# EAGLE design PARADAS -02 (EAGLE 6.5.0)
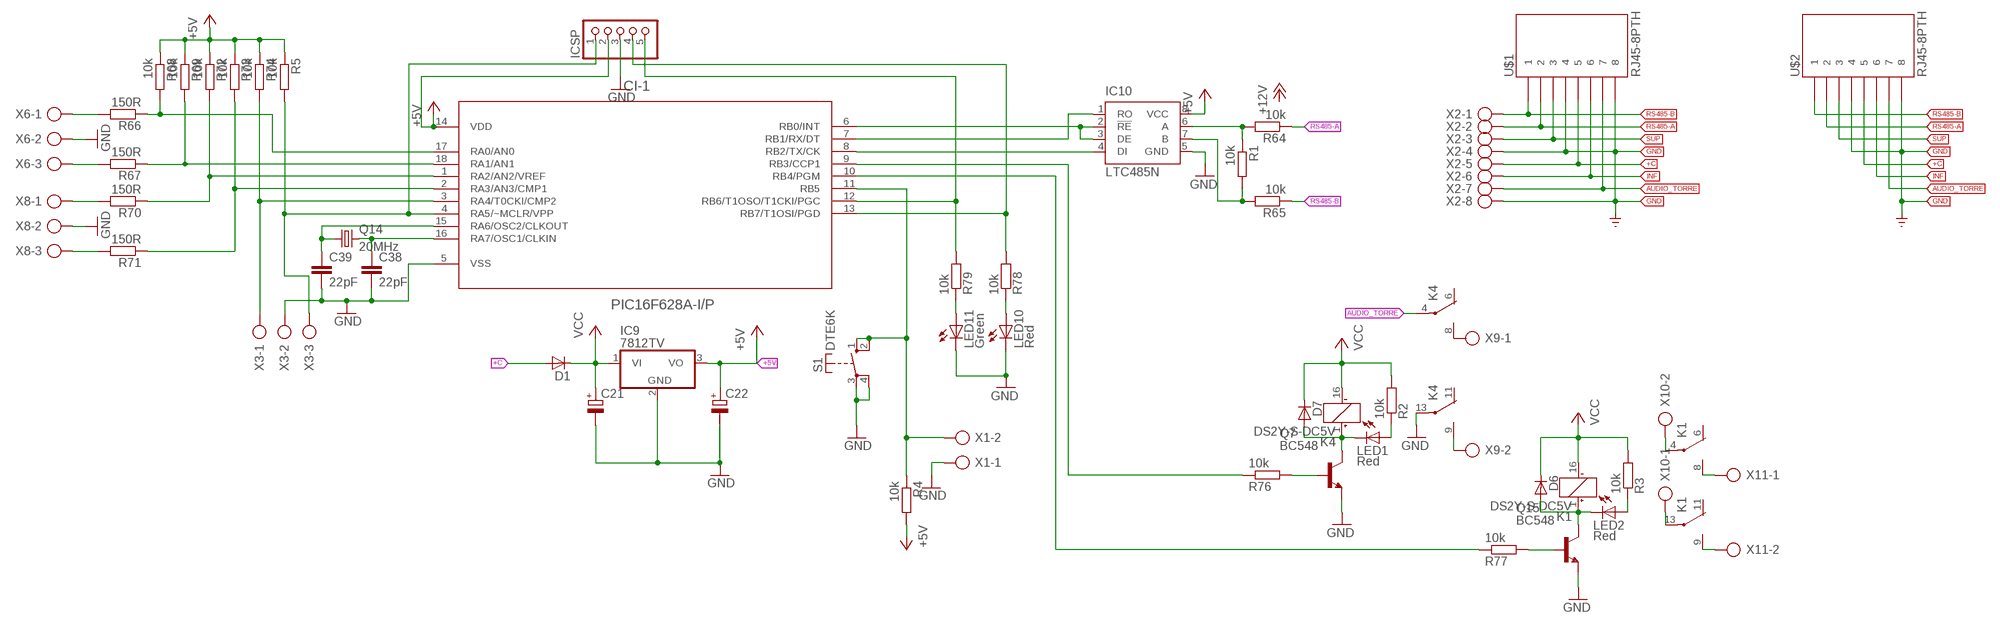
[diagram p0: schematic, sheet 1]

## Parts
C21  CPOL-EUE5-13  [E5-13]
C22  CPOL-EUE5-13  [E5-13]
C38  22pF  C-EUC0805  [C0805]
C39  22pF  C-EUC0805  [C0805]
CI-1  PIC16F628A-I/P  [DIP254P762X533-18]
D1  BYS10  [SOD106A]
D6  BYS10  [SOD106A]
D7  BYS10  [SOD106A]
IC9  7812TV  [TO220V]
IC10  LTC485N  [DIL08]
ICSP  PINHD-1X5  [1X05]
K1  DS2Y-S-DC5V  [DS2Y]
K4  DS2Y-S-DC5V  [DS2Y]
LED1  Red  LED5MM  [LED5MM]
LED2  Red  LED5MM  [LED5MM]
LED10  Red  LED5MM  [LED5MM]
LED11  Green  LED5MM  [LED5MM]
Q7  BC548  [TO92-EBC]
Q14  20MHz  CRYTALHC18U-V  [HC18U-V]
Q15  BC548  [TO92-EBC]
R1  10k  R-EU_0207/10  [0207/10]
R2  10k  R-EU_0207/10  [0207/10]
R3  10k  R-EU_0207/10  [0207/10]
R4  10k  R-EU_0207/10  [0207/10]
R5  10k  R-EU_0207/10  [0207/10]
R64  10k  R-EU_0207/10  [0207/10]
R65  10k  R-EU_0207/10  [0207/10]
R66  150R  R-EU_0207/10  [0207/10]
R67  150R  R-EU_0207/10  [0207/10]
R68  10k  R-EU_0207/10  [0207/10]
R69  10k  R-EU_0207/10  [0207/10]
R70  150R  R-EU_0207/10  [0207/10]
R71  150R  R-EU_0207/10  [0207/10]
R72  10k  R-EU_0207/10  [0207/10]
R73  10k  R-EU_0207/10  [0207/10]
R74  10k  R-EU_0207/10  [0207/10]
R76  10k  R-EU_0207/10  [0207/10]
R77  10k  R-EU_0207/10  [0207/10]
R78  10k  R-EU_0207/10  [0207/10]
R79  10k  R-EU_0207/10  [0207/10]
S1  DTE6K  [DTE6K]
U$1  RJ45-8PTH  [RJ45-8]
U$2  RJ45-8PTH  [RJ45-8]
X1  AK500/2  [AK500/2]
X2  RS485_CNT  AK500/8  [AK500/8]
X3  AK500/3  [AK500/3]
X6  AK500/3  [AK500/3]
X8  AK500/3  [AK500/3]
X9  AK500/2  [AK500/2]
X10  AK500/2  [AK500/2]
X11  AK500/2  [AK500/2]

## Nets
+5V [power]: C22.+ CI-1.14(VDD) IC9.3(VO) IC10.8(VCC) ICSP.2 R4.2 R5.1 R68.1 R69.1 R72.1 R73.1 R74.1
+C [AC]: D1.A U$1.5 U$2.5 X2.5
AUDIO_TORRE [AC]: K4.4(2:P) U$1.7 U$2.7 X2.7
GND [power]: C21.- C22.- C38.2 C39.2 CI-1.5(VSS) IC9.2(GND) IC10.5(GND) ICSP.3 K4.13(3:P) LED10.K(C) LED11.K(C) Q7.E Q15.E S1.3(P) S1.4(P) U$1.4 U$1.8 U$2.4 U$2.8 X1.1 X2.4 X2.8 X3.2 X6.2 X8.2
INF [power]: U$1.6 U$2.6 X2.6
N$1: LED1.A R2.1
N$2: IC10.7(B) R1.2 R65.2
N$3: IC10.6(A) R1.1 R64.2
N$4: LED2.A R3.1
N$5: CI-1.11(RB5) R4.1 S1.1(S) S1.2(S) X1.2
N$6: CI-1.8(RB2/TX/CK) IC10.4(DI)
N$7 [AC]: K1.4(2:P) X10.2
N$8: CI-1.6(RB0/INT) IC10.2(!RE) IC10.3(DE)
N$9 [AC]: K1.13(3:P) X10.1
N$12: CI-1.4(RA5/~MCLR/VPP) ICSP.1 R5.2 X3.3
N$13: CI-1.13(RB7/T1OSI/PGD) ICSP.4 R78.2
N$14: CI-1.12(RB6/T1OSO/T1CKI/PGC) ICSP.5 R79.2
N$16: CI-1.7(RB1/RX/DT) IC10.1(RO)
N$20: C38.1 CI-1.16(RA7/OSC1/CLKIN) Q14.2
N$22: C39.1 CI-1.15(RA6/OSC2/CLKOUT) Q14.1
N$23: R66.2 X6.1
N$24: CI-1.17(RA0/AN0) R66.1 R68.2
N$26: R67.2 X6.3
N$28: R70.2 X8.1
N$29: CI-1.1(RA2/AN2/VREF) R70.1 R72.2
N$30: CI-1.18(RA1/AN1) R67.1 R69.2
N$32: CI-1.2(RA3/AN3/CMP1) R71.1 R73.2
N$33: R71.2 X8.3
N$36: CI-1.3(RA4/T0CKI/CMP2) R74.2 X3.1
N$37 [AC]: K4.8(2:S) X9.1
N$38 [AC]: K4.9(3:S) X9.2
N$41: D7.A K4.1(1:+) LED1.K(C) Q7.C
N$42: Q7.B R76.2
N$43 [AC]: K1.9(3:S) X11.2
N$45 [AC]: K1.8(2:S) X11.1
N$46: CI-1.9(RB3/CCP1) R76.1
N$47: CI-1.10(RB4/PGM) R77.1
N$48: D6.A K1.1(1:+) LED2.K(C) Q15.C
N$50: Q15.B R77.2
N$54: LED10.A R78.1
N$55: LED11.A R79.1
RS485-A [power]: R64.1 U$1.2 U$2.2 X2.2
RS485-B [power]: R65.1 U$1.1 U$2.1 X2.1
SUP [power]: U$1.3 U$2.3 X2.3
VCC [power]: C21.+ D1.K D6.K D7.K IC9.1(VI) K1.16(1:-) K4.16(1:-) R2.2 R3.2
Unconnected: K1.6(2:O) K1.11(3:O) K4.6(2:O) K4.11(3:O)

## Library data of the parts
C21 C22 = rcl:CPOL-EU: POLARIZED CAPACITOR, European symbol
C38 C39 = rcl:C-EU: CAPACITOR, European symbol
CI-1 = Microchip_By_element14_Batch_1 (2):PIC16F628A-I/P: 8 Bit CMOS Microcontrollers; DESCRIPTION: 8 Bit CMOS Microcontrollers; MPN: PIC16F628A-I/P; OC_FARNELL: 9760423; OC_NEWARK: 92C4532; PACKAGE: DIP-18; SUPPLIER: Microchip
D1 D6 D7 = telefunken:BYS10: DIODE; MPN: BYS10/45; OC_FARNELL: 9549188; OC_NEWARK: 96K7236
IC9 = linear:78*: Positive VOLTAGE REGULATOR Source: http://cache.national.com/ds/LM/LM78L05.pdf http://www.fairchildsemi.com/ds/LM/LM7805.pdf
IC10 = linear-technology:LTC485: Low Power RS485 Interface Transceiver Source: http://www.linear.com/pc/downloadDocument.do?navId=H0,C1,C1007,C1017,P2064,D1718; OC_FARNELL: unknown; OC_NEWARK: unknown
ICSP = pinhead:PINHD-1X5: PIN HEADER
K1 K4 = relay:DS2Y-S-DC*: MINIATURE RELAY NAiS Source: http://www.mew-europe.com/.. en_ds_61005_0023.pdf; MPN: DS2Y-S-DC5V; OC_FARNELL: unknown; OC_NEWARK: 13P3268
LED1 LED2 LED10 LED11 = led:LED: LED OSRAM: - CHIPLED LG R971, LG N971, LY N971, LG Q971, LY Q971, LO R971, LY R971 LH N974, LH R974 LS Q976, LO Q976, LY Q976 LO Q996 - Hyper CHIPLED LW Q18S LB Q993, LB Q99A, LB R99A - SideLED LS A670, LO A670, LY A670, LG A670, LP A670 LB A673, LV A673, LT A673, LW A673 LH A674 LY A675 LS A676, LA A676, LO A676, LY A676, LW A676 LS A679, LY A679, LG A679 - Hyper Micro SIDELED® LS Y876, LA Y876, LO Y876, LY Y876 LT Y87S - SmartLED LW L88C, LW L88S LB L89C, LB L89S, LG L890 LS L89K, LO L89K, LY L89K LS L896, LA L896, LO L896, LY L896 - TOPLED LS T670, LO T670, LY T670, LG T670, LP T670 LSG T670, LSP T670, LSY T670, LOP T670, LYG T670 LG T671, LOG T671, LSG T671 LB T673, LV T673, LT T673, LW T673 LH T674 LS T676, LA T676, LO T676, LY T676, LB T676, LH T676, LSB T676, LW T676 LB T67C, LV T67C, LT T67C, LS T67K, LO T67K, LY T67K, LW E67C LS E67B, LA E67B, LO E67B, LY E67B, LB E67C, LV E67C, LT E67C LW T67C LS T679, LY T679, LG T679 LS T770, LO T770, LY T770, LG T770, LP T770 LB T773, LV T773, LT T773, LW T773 LH T774 LS E675, LA E675, LY E675, LS T675 LS T776, LA T776, LO T776, LY T776, LB T776 LHGB T686 LT T68C, LB T68C - Hyper Mini TOPLED® LB M676 - Mini TOPLED Santana® LG M470 LS M47K, LO M47K, LY M47K Source: http://www.osram.convergy.de LUXEON: - LUMILED® LXK2-PW12-R00, LXK2-PW12-S00, LXK2-PW14-U00, LXK2-PW14-V00 LXK2-PM12-R00, LXK2-PM12-S00, LXK2-PM14-U00 LXK2-PE12-Q00, LXK2-PE12-R00, LXK2-PE12-S00, LXK2-PE14-T00, LXK2-PE14-U00 LXK2-PB12-K00, LXK2-PB12-L00, LXK2-PB12-M00, LXK2-PB14-N00, LXK2-PB14-P00, LXK2-PB14-Q00 LXK2-PR12-L00, LXK2-PR12-M00, LXK2-PR14-Q00, LXK2-PR14-R00 LXK2-PD12-Q00, LXK2-PD12-R00, LXK2-PD12-S00 LXK2-PH12-R00, LXK2-PH12-S00 LXK2-PL12-P00, LXK2-PL12-Q00, LXK2-PL12-R00 Source: www.luxeon.com KINGBRIGHT: KA-3528ASYC Source: www.kingbright.com
Q7 Q15 = transistor-npn:BC548*: NPN Transistor
Q14 = crystal:CRYTAL: CRYSTAL
R1-R5 R64-R74 R76-R79 = rcl:R-EU_: RESISTOR, European symbol
S1 = switch-misc:DT: ITT SWITCH
U$1 U$2 = SparkFun-Connectors:RJ45-8: RJ45 Jack Simple RJ45, 8-pin connection - connector for common Cat5, Cat5e, and Cat6 Ethernet cables. Footprint not yet proven in production. Connector sku is PRT-00643; Breakout PCB sku is BOB-00716.
X1 X9-X11 = con-ptr500:AK500/2: CONNECTOR; OC_FARNELL: unknown; OC_NEWARK: unknown
X2 = con-ptr500:AK500/8: CONNECTOR; OC_FARNELL: unknown; OC_NEWARK: unknown
X3 X6 X8 = con-ptr500:AK500/3: CONNECTOR; OC_FARNELL: unknown; OC_NEWARK: unknown

## Net classes
0 default: width 0.508 mm, drill 0.254 mm, clearance 0.203 mm
1 AC: width 1.524 mm, drill 0.254 mm, clearance 0.203 mm
2 power: width 0.762 mm, drill 0.254 mm, clearance 0.203 mm

## Board
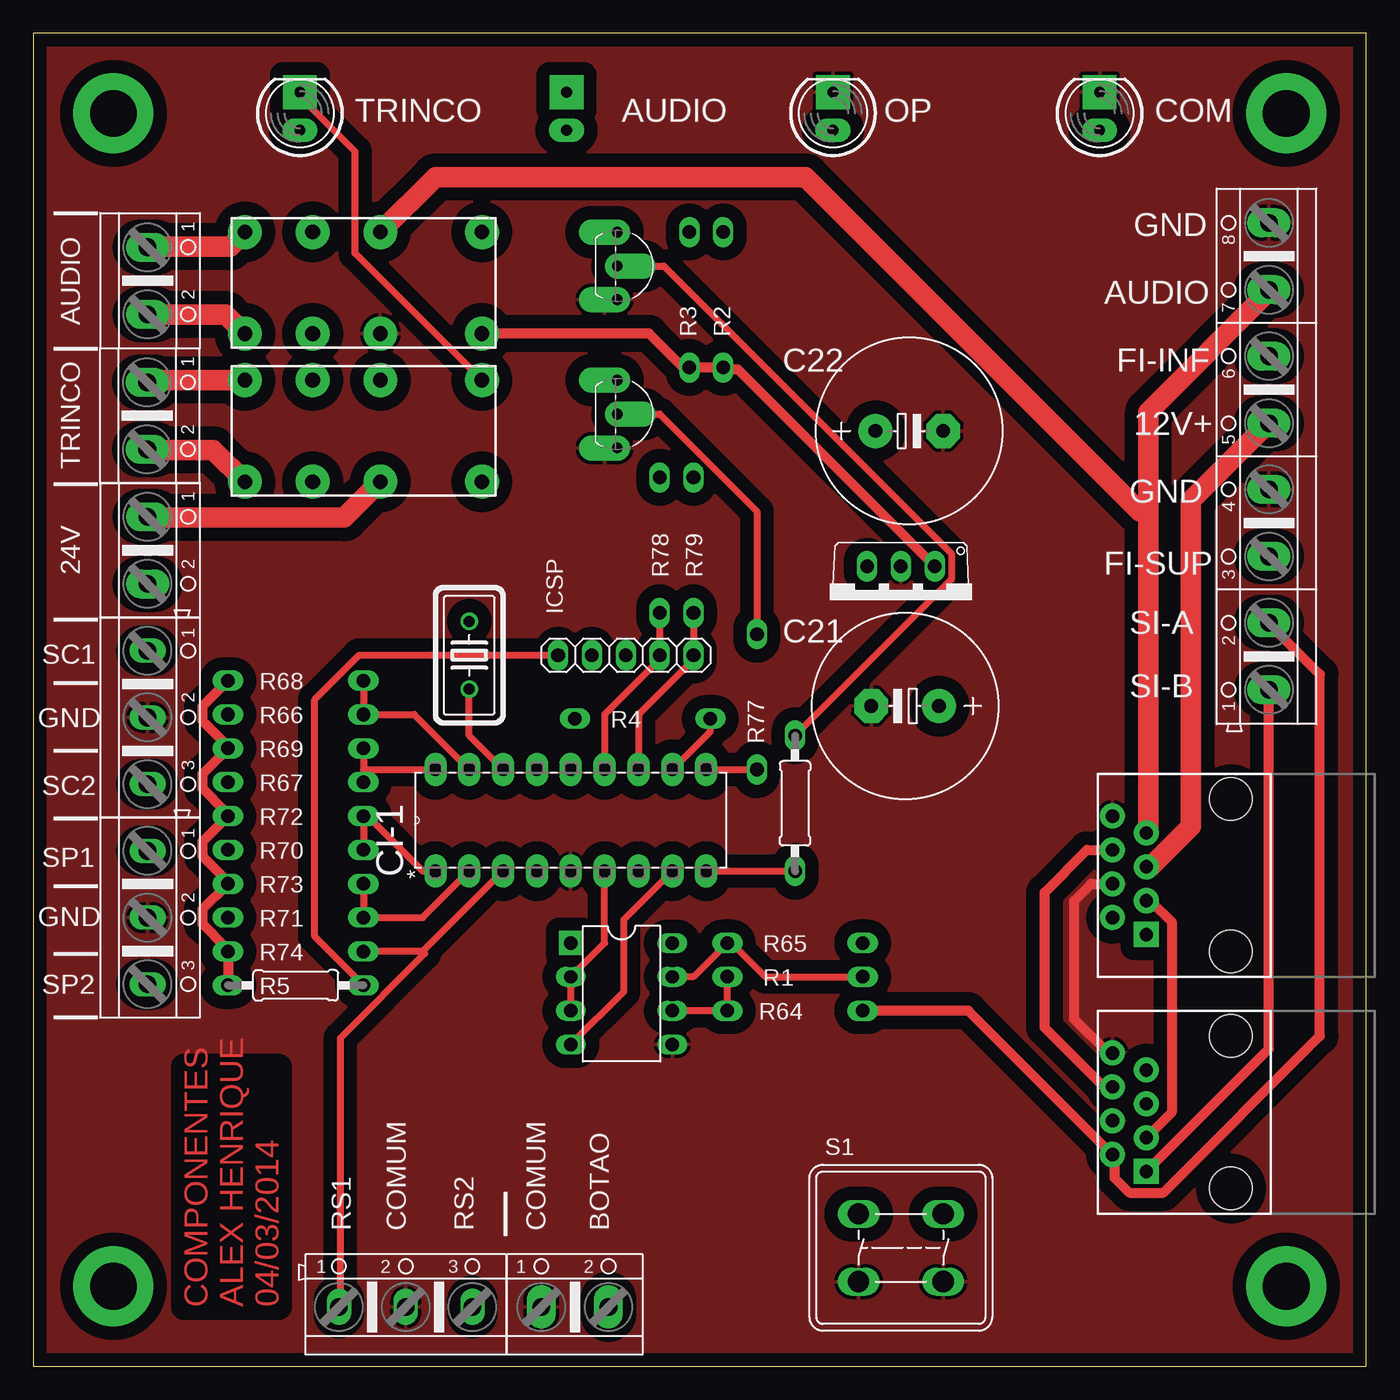
[diagram p1: board, top side]
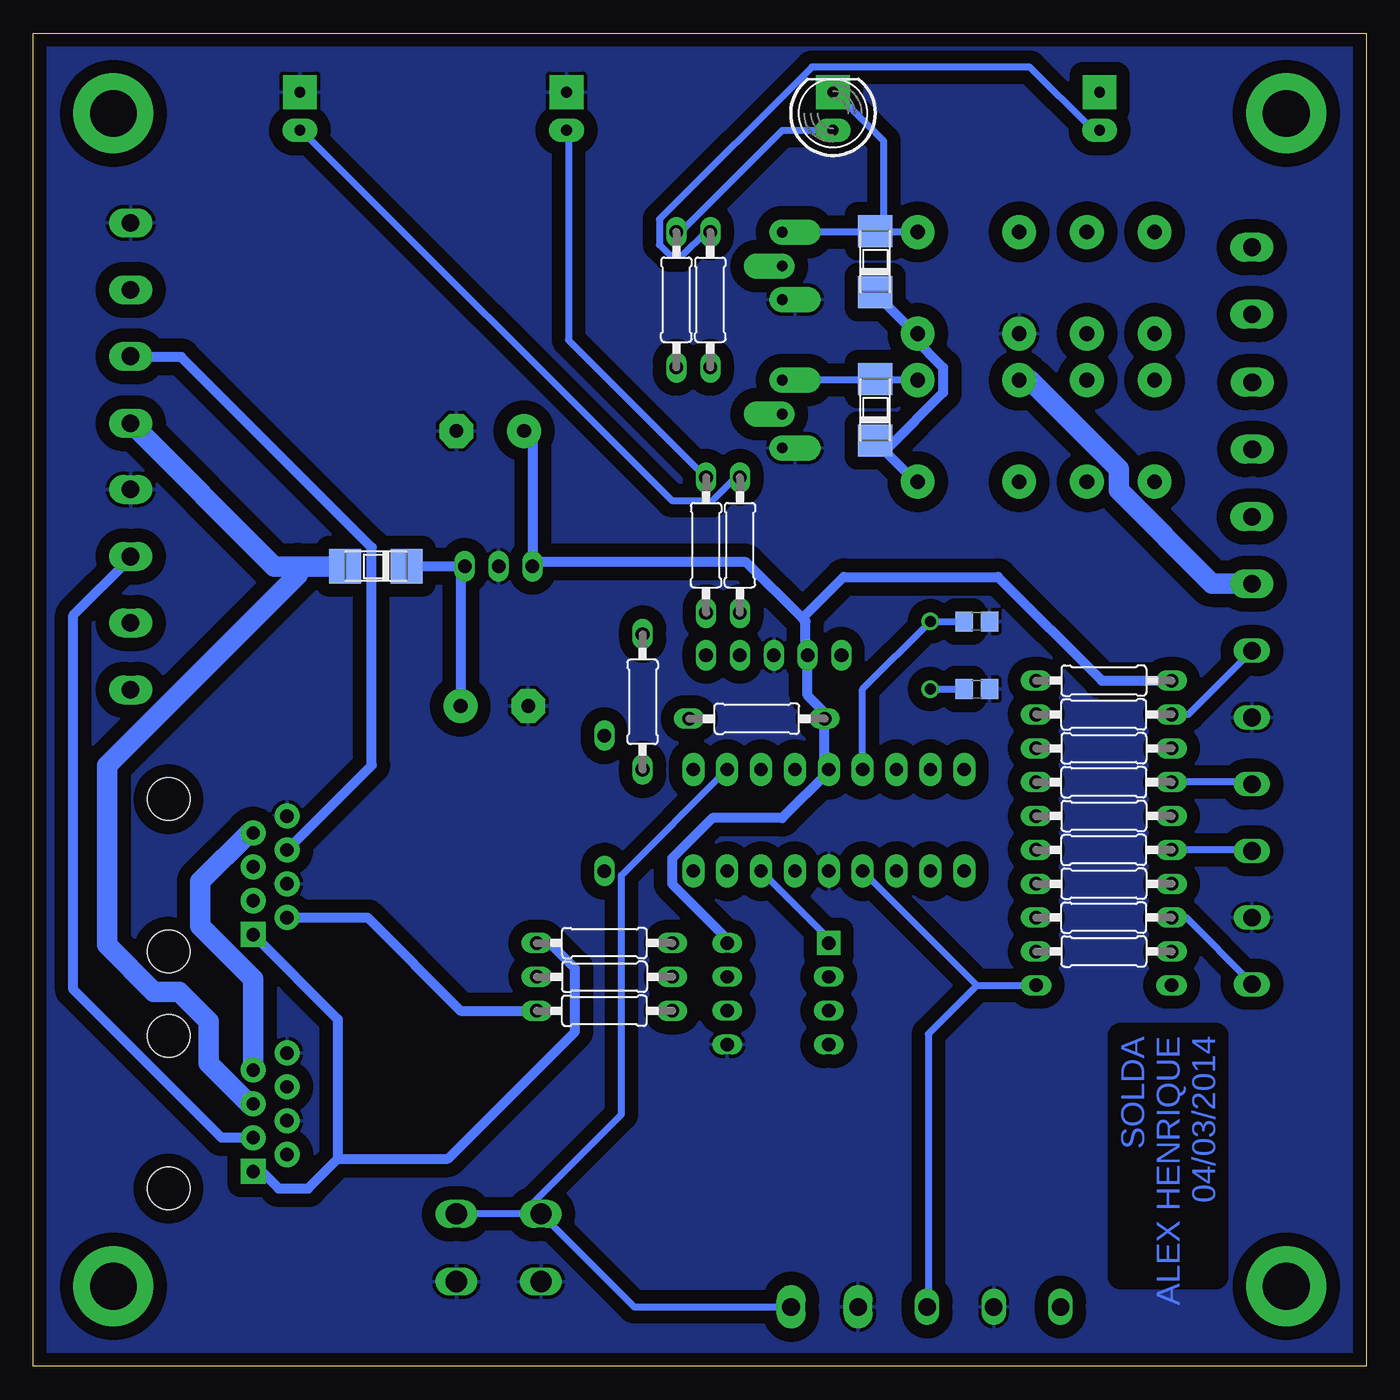
[diagram p2: board, bottom side, seen from below]

Size 100 x 100 mm. Coordinates in mm from the lower left corner, seen from the top.
Outline: 100,100 0,100 0,0 100,0 100,100
Copper layers (1*16): Top 0.035mm / dielectric 1.5mm / Bottom 0.035mm
Design rules "placa35": minimum track width 16mil, minimum drill 20mil, track to track 10mil, track to pad 10mil, pad to pad 10mil, via to via 10mil, smd to smd 10mil, copper to edge 20mil, drill to drill 10mil, minimum pad ring 10mil, minimum via ring 14mil, stop-mask expansion 4mil, vias tented up to drill 0mil, thermal gap 10mil

### Footprints (pad centres in the part's own frame; a part is rotated, then mirrored left to right if it is on the bottom)
E5-13 = drill 1.016 pad 2.54: + -2.54,0 | drill 1.016 pad 2.54 octagon: - 2.54,0
C0805 = smd 1.3 x 1.5: 1 -0.95,0; 2 0.95,0
DIP254P762X533-18 = drill 0.991 pad 1.676 long: 1 -7.62,20.32; 2 -7.62,17.78; 3 -7.62,15.24; 4 -7.62,12.7; 5 -7.62,10.16; 6 -7.62,7.62; 7 -7.62,5.08; 8 -7.62,2.54; 9 -7.62,0; 10 0,0; 11 0,2.54; 12 0,5.08; 13 0,7.62; 14 0,10.16; 15 0,12.7; 16 0,15.24; 17 0,17.78; 18 0,20.32
SOD106A = smd 2.4 x 2.6: A 2.3,0; K -2.3,0
TO220V = drill 1.016 long: 1 -2.54,-2.54; 2 0,-2.54; 3 2.54,-2.54
DIL08 = drill 1 pad 1.778 square: 1 -3.81,-3.81 | drill 1 pad 1.27 long: 2 -1.27,-3.81; 3 1.27,-3.81; 4 3.81,-3.81; 5 3.81,3.81; 6 1.27,3.81; 7 -1.27,3.81; 8 -3.81,3.81
1X05 = drill 1.016 long: 1 -5.08,0; 2 -2.54,0; 3 0,0; 4 2.54,0; 5 5.08,0
DS2Y = drill 1.1 pad 2.54: 1 -8.89,-3.81; 4 -1.27,-3.81; 6 3.81,-3.81; 8 8.89,-3.81; 9 8.89,3.81; 11 3.81,3.81; 13 -1.27,3.81; 16 -8.89,3.81
LED5MM = drill 0.813 pad 1.778 long: A -1.27,0 | drill 0.813 pad 2.54 square: K 1.587,0
TO92-EBC = drill 0.813 pad 1.93 offset: B 0,-1.27; C -2.54,-1.27; E 2.54,-1.27
HC18U-V = drill 0.813: 1 -2.54,0; 2 2.54,0
0207/10 = drill 1.016 pad 1.422 long: 1 -5.08,0; 2 5.08,0
DTE6K = drill 1.6 long: 1 -2.54,2.54; 2 3.81,2.54; 3 3.81,-2.54; 4 -2.54,-2.54
RJ45-8 = drill 1 pad 1.88 square: 1 -4.445,6.35 | drill 1 pad 1.88: 2 -3.175,8.89; 3 -1.905,6.35; 4 -0.635,8.89; 5 0.635,6.35; 6 1.905,8.89; 7 3.175,6.35; 8 4.445,8.89 | hole 3.2: -5.715,0; 5.715,0
AK500/2 = drill 1.321 pad 2.184 long: 1 -2.515,0; 2 2.515,0
AK500/8 = drill 1.321 pad 2.184 long: 1 -17.526,0; 2 -12.497,0; 3 -7.518,0; 4 -2.489,0; 5 2.489,0; 6 7.518,0; 7 12.497,0; 8 17.526,0
AK500/3 = drill 1.321 long: 1 -5.004,0; 2 0,0; 3 5.004,0

### Placement (x,y rotation side)
C21  65.41,49.53 180 top
C22  65.72,70.17 0 top
C38  29.21,50.8 0 bottom
C39  29.21,55.88 0 bottom
CI-1  50.48,44.77 90 top
D1  74.3,60.01 180 bottom
D6  36.83,71.75 90 bottom
D7  36.83,82.87 90 bottom
IC9  65.09,57.47 180 top
IC10  44.13,27.94 270 top
ICSP  44.45,53.34 0 top
K1  24.77,70.17 180 top
K4  24.77,81.28 180 top
LED1  40,94 90 bottom
LED2  20,94 90 top
LED10  80,94 90 top
LED11  60,94 90 top
Q7  45.09,82.55 270 top
Q14  32.7,53.34 270 top
Q15  45.09,71.44 270 top
R1  57.15,29.21 180 bottom
R2  51.75,80.01 270 bottom
R3  49.21,80.01 270 bottom
R4  45.72,48.58 0 bottom
R5  19.68,28.57 0 top
R64  57.15,26.67 0 bottom
R65  57.15,31.75 0 bottom
R66  19.68,48.9 0 bottom
R67  19.68,43.81 0 bottom
R68  19.68,51.44 180 bottom
R69  19.68,46.35 180 bottom
R70  19.68,38.73 0 bottom
R71  19.68,33.66 0 bottom
R72  19.68,41.27 180 bottom
R73  19.68,36.2 180 bottom
R74  19.68,31.11 180 bottom
R76  57.15,42.23 90 top
R77  54.29,49.85 90 bottom
R78  46.99,61.59 270 bottom
R79  49.53,61.59 270 bottom
S1  64.45,8.89 0 top
U$1  89.85,36.83 90 top
U$2  89.85,19.05 90 top
X1  40.64,4.45 0 top
X2  92.71,68.26 90 top
X3  27.94,4.45 0 top
X6  8.57,48.67 270 top
X8  8.57,33.66 270 top
X9  8.57,81.44 270 top
X10  8.57,61.21 270 top
X11  8.54,71.31 270 top

### Tracks (layer width: path | path; a pad name or v marks a point on that pad's centre or on a via)
+5V
  Top 0.762: R5.1 R74.1 14.45,31.43 12.7,33.18 12.7,34.29 R73.1 14.45,36.51 12.7,38.26 12.7,39.37 R72.1 14.45,41.59 12.7,43.34 12.7,44.45 R69.1 14.45,46.67 12.7,48.42 12.7,49.53 R68.1
  Bottom 0.762: C22.+ 62.55,69.53 IC9.3 62.23,60.33 46.51,60.33 42.31,56.12 | IC10.8 47.94,32.07 52.07,36.2 52.07,38.1 49.05,41.12 43.81,41.12 40.32,44.61 CI-1.14 40.64,44.93 R4.2 40.48,48.9 41.91,50.32 ICSP.2 42.07,53.66 42.07,55.88 42.31,56.12 | R68.1 19.84,51.44 27.62,59.21 39.21,59.21 42.31,56.12
+C
  Top 1.524: U$1.5 83.82,37.47 86.84,40.48 86.84,64.93 92.71,70.8 X2.5
  Bottom 1.524: 80.17,60.01 81.92,60.01 92.71,70.8 X2.5 | 80.17,60.01 D1.A | U$2.5 83.82,19.68 86.84,22.7 86.84,25.88 89.06,28.1 90.96,28.1 94.46,31.59 94.46,45.09 80.17,59.37 80.17,60.01
AUDIO_TORRE
  Top 1.524: 83.66,64.14 83.66,40.16 U$1.7 | 83.66,64.14 83.66,71.6 92.71,80.64 X2.7 | K4.4 30.16,89.22 57.94,89.22 83.03,64.14 83.66,64.14
  Bottom 1.524: U$2.7 83.5,29.05 87.47,33.02 87.47,36.35 83.82,40.01 U$1.7
GND
  Top 0.762: U$2.8 80.64,23.5 78.11,26.04 78.11,34.92 79.38,36.2 U$1.4
  pour Bottom (isolate 1): 0,100.01 100.01,100.01 100.01,0 0,0
  pour Top (isolate 1): 0,100.01 100.01,100.01 100.01,0 0,0
INF
  Top 0.762: 80.64,38.73 U$1.6 79.06,38.73 75.88,35.56 75.88,25.4 80.33,20.95 U$2.6
  Bottom 0.762: U$1.6 74.61,45.09 74.61,61.44 88.9,75.72 92.71,75.72 X2.6
N$1
  Bottom 0.508: R2.1 51.44,85.09 43.81,92.71 40.01,92.71 LED1.A
N$2
  Top 0.508: IC10.7 49.53,29.21 R65.2 52.23,31.91 54.93,29.21 R1.2
N$3
  Top 0.508: IC10.6 R64.2 R1.1
N$4
  Bottom 0.508: R3.1 49.53,85.09 51.28,83.34 52.23,83.34 53.02,84.14 53.02,86.04 41.59,97.47 25.24,97.47 20.64,92.87 20,92.87 LED2.A
N$5
  Top 0.508: R4.1 50.8,47.62 CI-1.11
  Bottom 0.508: X1.2 54.93,4.45 S1.1 | S1.1 S1.2 | CI-1.11 55.88,36.83 55.88,18.89 63.18,11.59 S1.1
N$6
  Top 0.508: IC10.4 44.29,28.1 44.29,33.5 CI-1.8
N$7
  Bottom 1.524: K1.4 25.24,73.98 18.57,67.31 18.57,65.72 11.59,58.74 8.57,58.74 X10.2
N$8
  Top 0.508: IC10.3 IC10.2 42.86,31.75 CI-1.6
N$9
  Top 1.524: K1.13 23.34,63.66 8.57,63.66 X10.1
N$11  (via drill 3.5 pad 6)
  other vias: 94,6
N$12
  Top 0.508: ICSP.1 24.45,53.34 21.11,50.01 21.11,32.23 R5.2
  Bottom 0.508: 29.21,28.57 R5.2 | CI-1.4 29.21,28.57 | 29.21,28.57 32.86,24.92 32.86,4.45 X3.3
N$13
  Top 0.508: R78.2 ICSP.4 47.15,53.18 42.86,48.9 CI-1.13
N$14
  Top 0.508: R79.2 ICSP.5 49.69,53.18 45.4,48.9 CI-1.12
N$15  (via drill 3.5 pad 6)
  other vias: 94,94
N$16
  Bottom 0.508: CI-1.7 40.32,32.07 IC10.1
N$17  (via drill 3.5 pad 6)
  other vias: 6,94
N$18  (via drill 3.5 pad 6)
  other vias: 6,6
N$20
  Top 0.508: Q14.2 32.7,47.31 CI-1.16
  Bottom 0.508: Q14.2 C38.1
N$22
  Bottom 0.508: C39.1 Q14.1 37.78,50.8 CI-1.15
N$23
  Bottom 0.508: R66.2 13.34,48.9 8.57,53.66 X6.1
N$24
  Top 0.508: R68.2 R66.1 28.57,48.9 CI-1.17
N$26
  Bottom 0.508: R67.2 8.57,43.81 X6.3
N$28
  Bottom 0.508: R70.2 8.57,38.73 X8.1
N$29
  Top 0.508: R70.1 R72.2 24.92,41.43 29.21,37.15 CI-1.1
N$30
  Top 0.508: R69.2 24.77,44.77 | 24.77,44.77 R67.1 | 24.77,44.77 CI-1.18
N$32
  Top 0.508: R73.2 R71.1 29.21,33.66 CI-1.2
N$33
  Bottom 0.508: R71.2 13.49,33.66 8.57,28.73 X8.3
N$36
  Top 0.508: 29.21,31.11 R74.2 | CI-1.3 29.21,31.11 | X3.1 23.02,4.45 23.02,24.61 29.37,30.96 29.21,31.11
N$37
  Top 1.524: K4.8 14.76,83.98 8.57,83.98 X9.1
N$38
  Top 1.524: K4.9 14.45,78.9 8.57,78.9 X9.2
N$41
  Bottom 0.508: K4.1 36.83,85.09 D7.A | Q7.C 36.99,85.09 D7.A | LED1.K 39.85,95.57 36.2,91.92 36.2,85.25 D7.A
N$42
  Top 0.508: R76.2 68.9,59.05 68.9,60.96 47.31,82.55 Q7.B
N$43
  Top 1.524: K1.9 13.49,68.74 8.57,68.74 X11.2
N$45
  Top 1.524: K1.8 8.57,73.98 X11.1
N$46
  Top 0.508: CI-1.9 R76.1
N$47
  Top 0.508: CI-1.10 R77.1
N$48
  Top 0.508: K1.1 24.13,83.5 24.13,91.12 20,95.25 20,95.57 LED2.K
  Bottom 0.508: K1.1 36.83,73.98 D6.A 36.99,73.98 Q15.C
N$50
  Top 0.508: R77.2 54.29,64.14 46.99,71.44 Q15.B
N$54
  Bottom 0.508: R78.1 47.31,66.67 49.05,64.93 52.07,64.93 79.85,92.71 LED10.A
N$55
  Bottom 0.508: R79.1 59.85,76.99 59.85,92.71 LED11.A
RS485-A
  Top 0.762: R64.1 70.17,26.67 U$2.2 81.12,15.56 81.12,14.13 82.23,13.02 84.77,13.02 96.52,24.77 96.52,51.91 92.71,55.72 X2.2
  Bottom 0.762: U$1.2 74.93,33.66 67.94,26.67 R64.1
RS485-B
  Top 0.762: X2.1 92.71,23.81 U$2.1
  Bottom 0.762: U$2.1 82.87,14.61 81.6,13.34 79.38,13.34 77.15,15.56 | 77.15,15.56 68.9,15.56 59.37,25.08 59.37,29.84 61.28,31.75 R65.1 | U$1.1 77.15,26.04 77.15,15.56
SUP
  Top 0.762: U$2.3 85.41,19.05 85.41,33.34 83.82,34.92 U$1.3
  Bottom 0.762: U$2.3 85.88,17.14 97,28.26 97,56.36 92.71,60.64 X2.3
VCC
  Top 0.762: IC9.1 52.86,74.77 52.07,74.77 R2.2 R3.2 48.9,74.77 46.2,77.47 K4.16
  Bottom 0.762: K1.16 33.81,66.36 36.83,69.37 D6.K 35.88,68.9 31.75,73.03 31.75,74.93 33.97,77.15 K4.16 33.81,77.47 36.83,80.49 D7.K | D1.K IC9.1 67.94,59.69 C21.+

### Text on the board
Top: COMPONENTES / ALEX HENRIQUE / 04/03/2014
Bottom: SOLDA / ALEX HENRIQUE / 04/03/2014
tPlace: | | AUDIO | | | TRINCO | | | 24V | | | SC1 | | | GND | | | SC2 | | | SP1 | | | GND | | | RS1 | COMUM | RS2 | COMUM | BOTAO
tNames: TRINCO | AUDIO | OP | COM | GND | AUDIO | FI-INF | 12V+ | GND | FI-SUP | SI-A | SI-B | SP2 | | | |